# Altium schematic sheet 10-ESP32.SchDoc: KARGOBOT-TBOX-V2.0
size 513 x 386 mm; Page Create Date: March  8, 1995; Page Number: 4; Page Size: C; Page Count: 81; RevCode: A; DsnPath: C:\Users\Administrator\Desktop\123\KARGOBOT-TCU-ORIN-V1.1.DSN; SchematicName: KARGOBT-TCU-ORIN-V1.1; PageName: N100; PageSize: C; TopSchematic: True
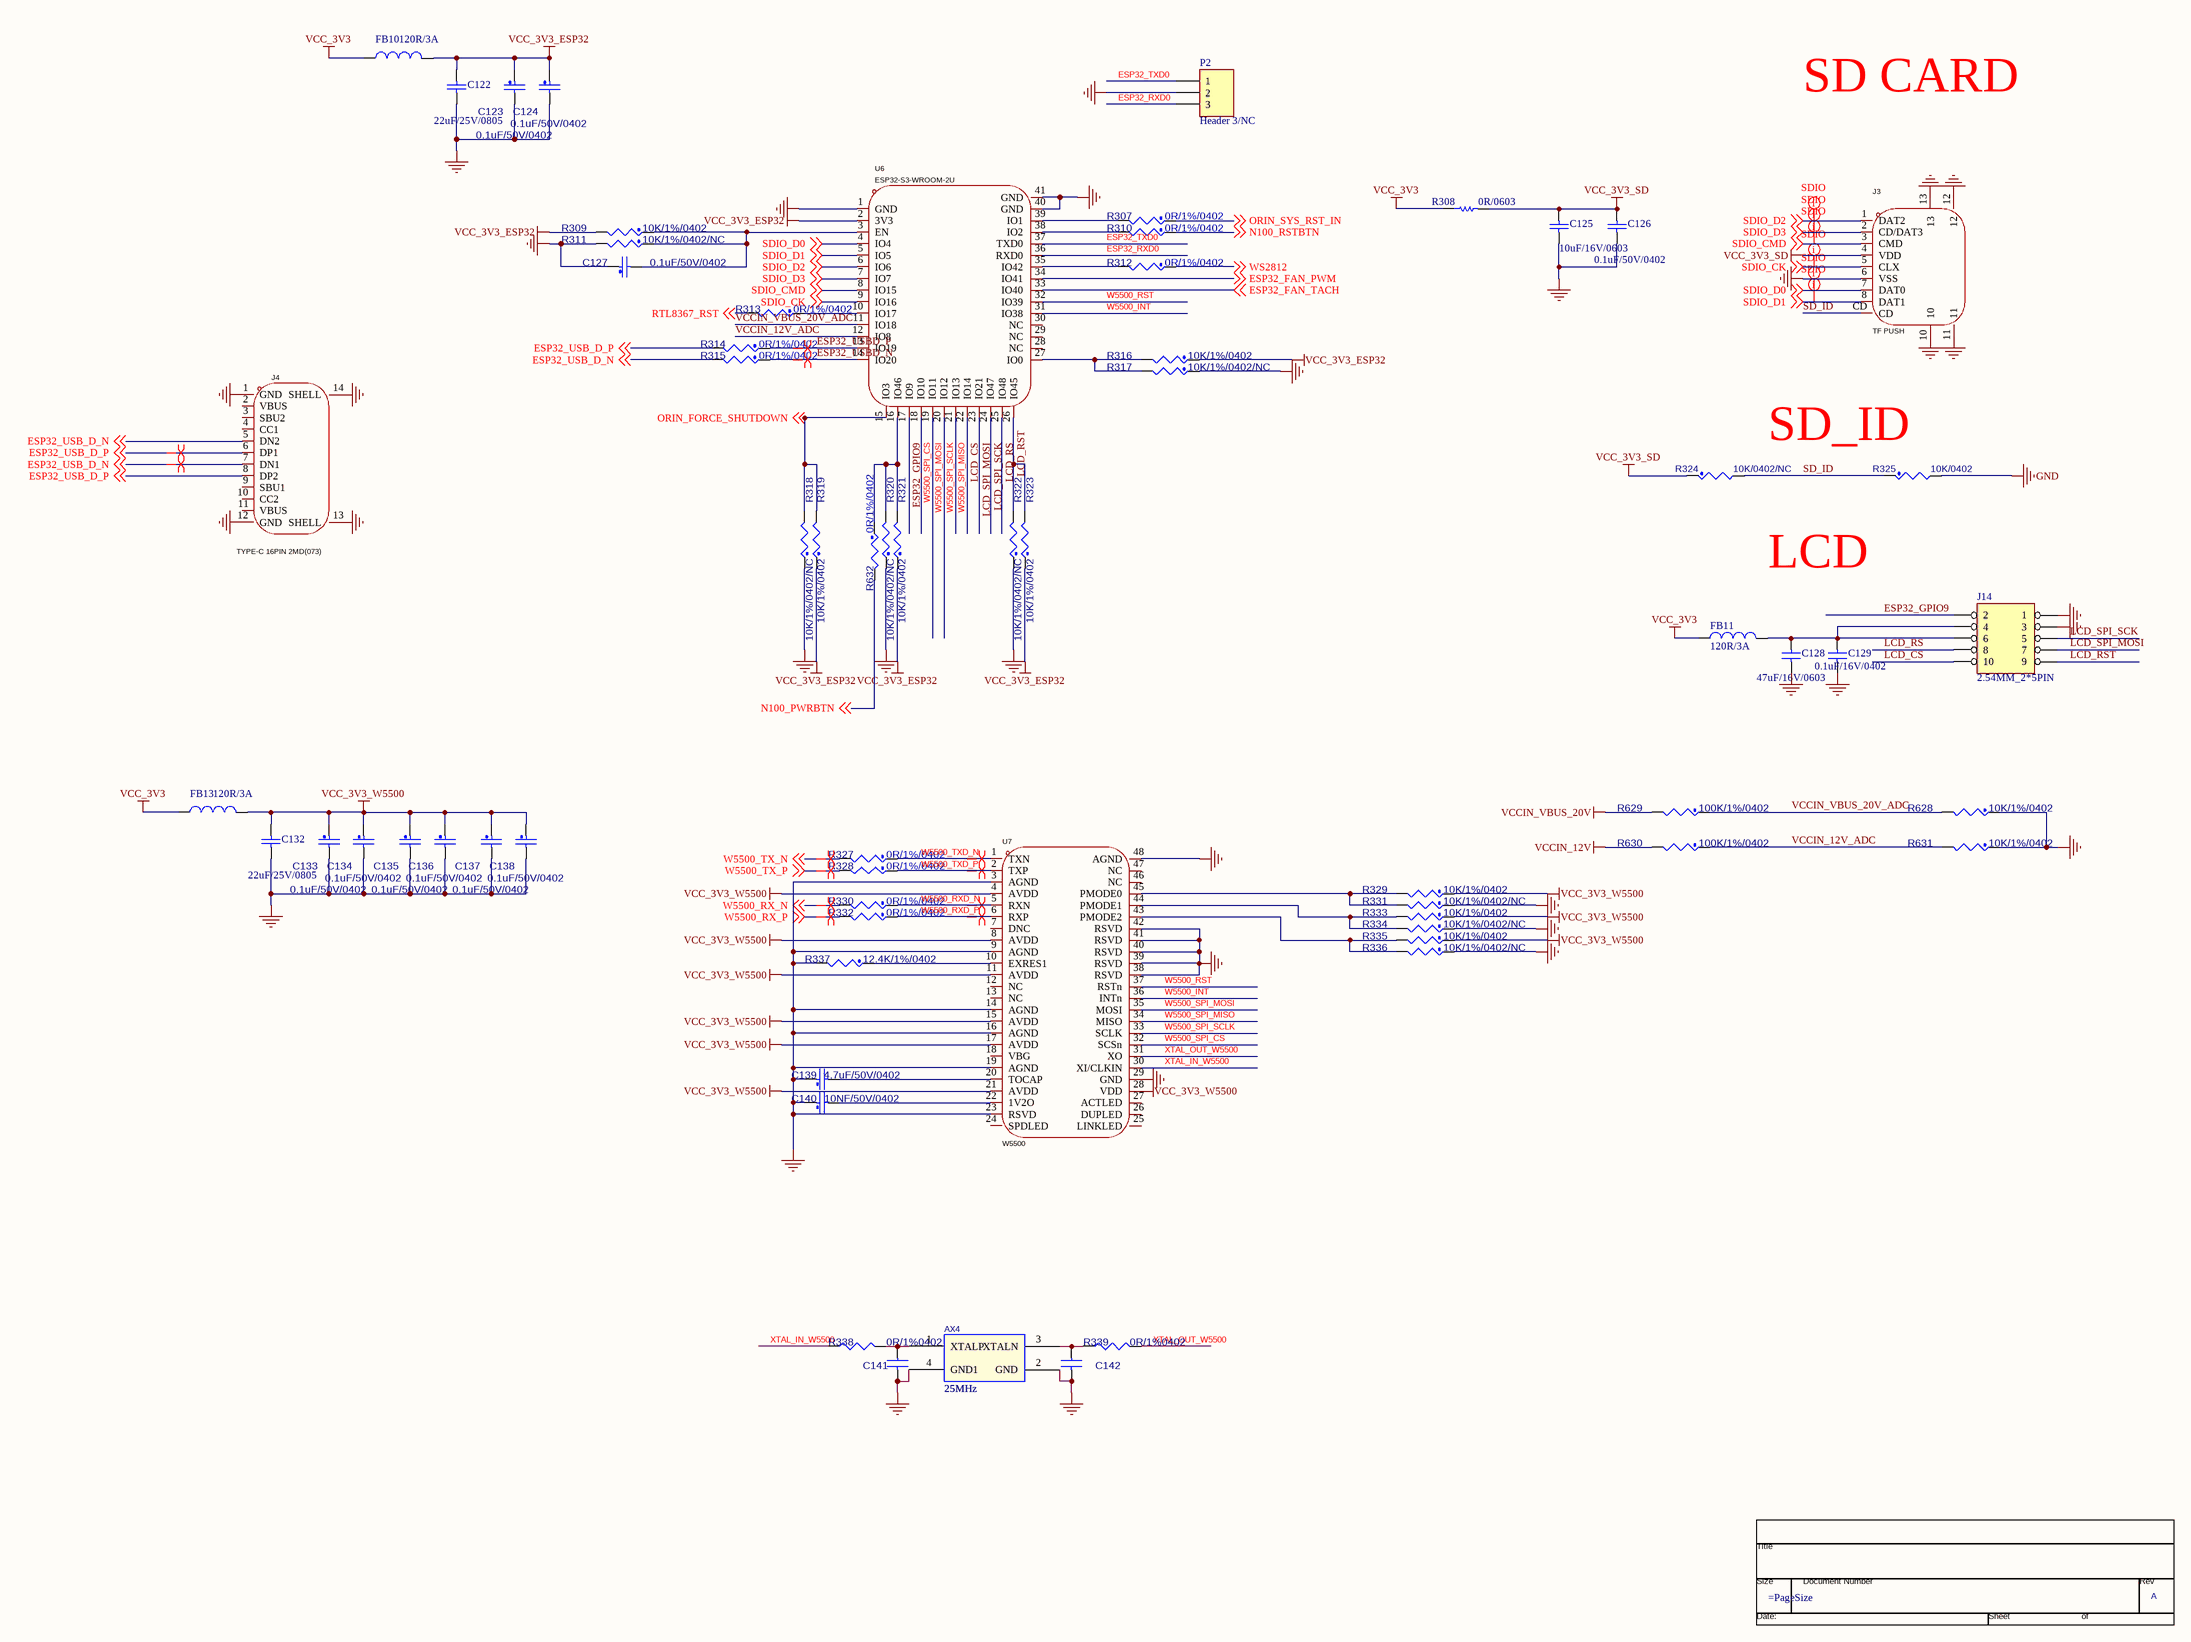
[diagram p0: 10-ESP32.SchDoc]

## Parts
*  RevCode: A  (graphical)
AX4  25MHz  [2016]
C122  22uF/25V/0805  [C0805]
C123  value 0.1uF/50V/0402  [C0402]  (hidden comment: CAP_NP)
C124  value 0.1uF/50V/0402  [C0402]  (hidden comment: CAP_NP)
C125  value 10uF/16V/0603  [C0603]  (hidden comment: HGC0603R5106M160NTHJ)
C126  0.1uF/50V/0402  [C0402]
C127  value 0.1uF/50V/0402  [C0402]  (hidden comment: CAP_NP)
C128  47uF/16V/0603  [C0603]
C129  0.1uF/16V/0402  [C0402]
C132  22uF/25V/0805  [C0805]
C133  value 0.1uF/50V/0402  [C0402]  (hidden comment: CAP_NP)
C134  value 0.1uF/50V/0402  [C0402]  (hidden comment: CAP_NP)
C135  value 0.1uF/50V/0402  [C0402]  (hidden comment: CAP_NP)
C136  value 0.1uF/50V/0402  [C0402]  (hidden comment: CAP_NP)
C137  value 0.1uF/50V/0402  [C0402]  (hidden comment: CAP_NP)
C138  value 0.1uF/50V/0402  [C0402]  (hidden comment: CAP_NP)
C139  value 4.7uF/50V/0402  [C0402]  (hidden comment: CAP_NP)
C140  value 10NF/50V/0402  [C0402]  (hidden comment: CAP_NP)
C141  CAP NP_Dup3  [C0402]  (value not drawn)
C142  CAP NP_Dup3  [C0402]  (value not drawn)
FB10  120R/3A  [L0603]
FB11  120R/3A  [L0603]
FB13  120R/3A  [L0603]
J3  TF PUSH  [TF-SMD_TF-PUSH]
J4  TYPE-C 16PIN 2MD(073)  [USB-C-SMD_TYPE-C-6PIN-2MD-073]
J14  2.54MM_2*5PIN  [IDC10]
P2  Header 3/NC  [HEADER3]
R307  value 0R/1%/0402  [R0402]  (hidden comment: RES_Dup2)
R308  0R/0603  [R0603]
R309  value 10K/1%/0402  [R0402]  (hidden comment: RES_Dup2)
R310  value 0R/1%/0402  [R0402]  (hidden comment: RES_Dup2)
R311  value 10K/1%/0402/NC  [R0402]  (hidden comment: RES_Dup2)
R312  value 0R/1%/0402  [R0402]  (hidden comment: RES_Dup2)
R313  value 0R/1%/0402  [R0402]  (hidden comment: RES_Dup2)
R314  value 0R/1%/0402  [R0402]  (hidden comment: RES_Dup2)
R315  value 0R/1%/0402  [R0402]  (hidden comment: RES_Dup2)
R316  value 10K/1%/0402  [R0402]  (hidden comment: RES_Dup2)
R317  value 10K/1%/0402/NC  [R0402]  (hidden comment: RES_Dup2)
R318  value 10K/1%/0402/NC  [R0402]  (hidden comment: RES_Dup2)
R319  value 10K/1%/0402  [R0402]  (hidden comment: RES_Dup2)
R320  value 10K/1%/0402/NC  [R0402]  (hidden comment: RES_Dup2)
R321  value 10K/1%/0402  [R0402]  (hidden comment: RES_Dup2)
R322  value 10K/1%/0402/NC  [R0402]  (hidden comment: RES_Dup2)
R323  value 10K/1%/0402  [R0402]  (hidden comment: RES_Dup2)
R324  10K/0402/NC  [R0402]
R325  10K/0402  [R0402]
R327  value 0R/1%/0402  [R0402]  (hidden comment: RES_Dup2)
R328  value 0R/1%/0402  [R0402]  (hidden comment: RES_Dup2)
R329  value 10K/1%/0402  [R0402]  (hidden comment: RES_Dup2)
R330  value 0R/1%/0402  [R0402]  (hidden comment: RES_Dup2)
R331  value 10K/1%/0402/NC  [R0402]  (hidden comment: RES_Dup2)
R332  value 0R/1%/0402  [R0402]  (hidden comment: RES_Dup2)
R333  value 10K/1%/0402  [R0402]  (hidden comment: RES_Dup2)
R334  value 10K/1%/0402/NC  [R0402]  (hidden comment: RES_Dup2)
R335  value 10K/1%/0402  [R0402]  (hidden comment: RES_Dup2)
R336  value 10K/1%/0402/NC  [R0402]  (hidden comment: RES_Dup2)
R337  value 12.4K/1%/0402  [R0402]  (hidden comment: RES_Dup2)
R338  value 0R/1%0402  [R0402]  (hidden comment: R_Dup3)
R339  value 0R/1%0402  [R0402]  (hidden comment: R_Dup3)
R628  value 10K/1%/0402  [R0402]  (hidden comment: RES_Dup2)
R629  value 100K/1%/0402  [R0402]  (hidden comment: RES_Dup2)
R630  value 100K/1%/0402  [R0402]  (hidden comment: RES_Dup2)
R631  value 10K/1%/0402  [R0402]  (hidden comment: RES_Dup2)
R632  value 0R/1%/0402  [R0402]  (hidden comment: RES_Dup2)
U6  ESP32-S3-WROOM-2U  [ESP32-S3-WROOM-2]
U7  W5500  [LQFP-48_L7.0-W7.0-P0.50-LS9.0-BL]

## Nets
GND: AX4.2(GND) AX4.4(GND1) C122.1 C123.2 C124.2 C125.1 C126.1 C127.1 C128.1 C129.1 C132.1 C133.2 C134.2 C135.2 C136.2 C137.2 C138.2 C139.1 C140.1 C141.2 C142.2 J3.6(VSS) J3.10 J3.11 J3.12 J3.13 J4.1(GND) J4.12(GND) J4.13(SHELL) J4.14(SHELL) J14.1 J14.3 P2.2 R311.2 R317.1 R318.1 R320.1 R322.1 R325.2 R331.1 R334.1 R336.1 R337.2 R628.1 R631.1 U6.1(GND) U6.40(GND) U6.41(GND) U7.3(AGND) U7.9(AGND) U7.14(AGND) U7.16(AGND) U7.19(AGND) U7.23(RSVD) U7.29(GND) U7.38(RSVD) U7.39(RSVD) U7.40(RSVD) U7.41(RSVD) U7.42(RSVD) U7.48(AGND)
VCC_3V3: FB10.1 FB11.2 FB13.1 R308.1
VCC_3V3_ESP32: C122.2 C123.1 C124.1 FB10.2 R309.2 R316.1 R319.1 R321.1 R323.1 U6.2(3V3)
VCC_3V3_SD: C125.2 C126.2 J3.4(VDD) R308.2 R324.1
VCC_3V3_W5500: C132.2 C133.1 C134.1 C135.1 C136.1 C137.1 C138.1 FB13.2 R329.1 R333.1 R335.1 U7.4(AVDD) U7.8(AVDD) U7.11(AVDD) U7.15(AVDD) U7.17(AVDD) U7.21(AVDD) U7.28(VDD)
VCCIN_12V: R630.2
VCCIN_VBUS_20V: R629.2
ESP32_FAN_PWM: U6.34(IO41) ; off-sheet ESP32_FAN_PWM
ESP32_FAN_TACH: U6.33(IO40) ; off-sheet ESP32_FAN_TACH
ESP32_GPIO9: J14.2 U6.17(IO9)
ESP32_RXD0: P2.3 U6.36(RXD0)
ESP32_TXD0: P2.1 U6.37(TXD0)
ESP32_USB_D_N: J4.5(DN2) J4.7(DN1) R315.2 ; off-sheet ESP32_USB_D_N
ESP32_USB_D_P: J4.6(DP1) J4.8(DP2) R314.2 ; off-sheet ESP32_USB_D_P
ESP32_USBD_N: R315.1 U6.14(IO20)
ESP32_USBD_P: R314.1 U6.13(IO19)
LCD_CS: J14.10 U6.22(IO14)
LCD_RS: J14.8 U6.25(IO48)
LCD_RST: J14.9 R322.2 R323.2 U6.26(IO45)
LCD_SPI_MOSI: J14.7 U6.23(IO21)
LCD_SPI_SCK: J14.5 U6.24(IO47)
N100_PWRBTN: R632.2 ; off-sheet N100_PWRBTN
N100_RSTBTN: R310.1 ; off-sheet N100_RSTBTN
ORIN_FORCE_SHUTDOWN: R318.2 R319.2 U6.15(IO3) ; off-sheet ORIN_FORCE_SHUTDOWN
ORIN_SYS_RST_IN: R307.1 ; off-sheet ORIN_SYS_RST_IN
RTL8367_RST: R313.2 ; off-sheet RTL8367_RST
SD_ID: J3.CD R324.2 R325.1
SDIO_CK: J3.5(CLX) U6.9(IO16) ; off-sheet SDIO_CK
SDIO_CMD: J3.3(CMD) U6.8(IO15) ; off-sheet SDIO_CMD
SDIO_D0: J3.7(DAT0) U6.4(IO4) ; off-sheet SDIO_D0
SDIO_D1: J3.8(DAT1) U6.5(IO5) ; off-sheet SDIO_D1
SDIO_D2: J3.1(DAT2) U6.6(IO6) ; off-sheet SDIO_D2
SDIO_D3: J3.2(CD/DAT3) U6.7(IO7) ; off-sheet SDIO_D3
VCCIN_12V_ADC: R630.1 R631.2 U6.12(IO8)
VCCIN_VBUS_20V_ADC: R628.2 R629.1 U6.11(IO18)
W5500_INT: U6.31(IO38) U7.36(INTn)
W5500_RST: U6.32(IO39) U7.37(RSTn)
W5500_RX_N: R330.2 ; off-sheet W5500_RX_N
W5500_RX_P: R332.2 ; off-sheet W5500_RX_P
W5500_RXD_N: R330.1 U7.5(RXN)
W5500_RXD_P: R332.1 U7.6(RXP)
W5500_SPI_CS: U6.18(IO10) U7.32(SCSn)
W5500_SPI_MISO: U6.21(IO13) U7.34(MISO)
W5500_SPI_MOSI: U6.19(IO11) U7.35(MOSI)
W5500_SPI_SCLK: U6.20(IO12) U7.33(SCLK)
W5500_TX_N: R327.2 ; off-sheet W5500_TX_N
W5500_TX_P: R328.2 ; off-sheet W5500_TX_P
W5500_TXD_N: R327.1 U7.1(TXN)
W5500_TXD_P: R328.1 U7.2(TXP)
WS2812: R312.1 ; off-sheet WS2812
XTAL_IN_W5500: R338.1 U7.30(XI/CLKIN)
XTAL_OUT_W5500: R339.2 U7.31(XO)
NetAX4_1: AX4.1(XTALP) C141.1 R338.2
NetAX4_3: AX4.3(XTALN) C142.1 R339.1
NetC127_2: C127.2 R309.1 R311.1 U6.3(EN)
NetC128_2: C128.2 C129.2 FB11.1 J14.4 J14.6
NetC139_2: C139.2 U7.20(TOCAP)
NetC140_2: C140.2 U7.22(1V2O)
NetR307_2: R307.2 U6.39(IO1)
NetR310_2: R310.2 U6.38(IO2)
NetR312_2: R312.2 U6.35(IO42)
NetR313_1: R313.1 U6.10(IO17)
NetR316_2: R316.2 R317.2 U6.27(IO0)
NetR320_2: R320.2 R321.2 R632.1 U6.16(IO46)
NetR329_2: R329.2 R331.2 U7.45(PMODE0)
NetR333_2: R333.2 R334.2 U7.44(PMODE1)
NetR335_2: R335.2 R336.2 U7.43(PMODE2)
NetR337_1: R337.1 U7.10(EXRES1)

Not connected (* = marked no-connect by the designer): J4 2(VBUS) 3(SBU2) 4(CC1) 9(SBU1) 10(CC2) 11(VBUS); U6 28(NC) 29(NC) 30(NC); U7 7(DNC) 12(NC) 13(NC) 18(VBG) 24(SPDLED) 25(LINKLED) 26(DUPLED) 27(ACTLED) 46(NC) 47(NC)

## Layout directives
net class SDIO: SDIO_CK, SDIO_CMD, SDIO_D0, SDIO_D1, SDIO_D2, SDIO_D3
differential pair: ESP32_USB_D_N, ESP32_USB_D_P, ESP32_USBD_N, ESP32_USBD_P, W5500_RX_N, W5500_RX_P, W5500_RXD_N, W5500_RXD_P, W5500_TX_N, W5500_TX_P, W5500_TXD_N, W5500_TXD_P

## Notes on the sheet
- SD CARD
- (near R325) SD_ID
- LCD
- (in symbol TitleBlock0) Title; Size; Document Number; Rev; Date:; Sheet; of

## Library data of the parts
* = TitleBlock0: Page Count: 81; Page Number: 4; Title: KARGOBOT-TBOX-V2.0; Page Size: =PageSize; Page Create Date: March  8, 1995; Page Modify Date: =ModifiedDate
AX4 = XTAL_0: Part Reference: AX3; PCB Footprint: CRY5032; Value: 25MHz
C122 C126 C128 C129 C132 = CAP: Capacitor; Value: 100pF; Published: 8-Jun-2000; Revision: July-2002: Re-released for DXP Platform.; Publisher: Altium Limited
C123 C124 C127 C133-C140 = CAP_NP: GCM155R71H104KE02/MURATA; Part Reference: C15; CLASS: DISCRETE; FPLIST: CC0402_25,CC0402_HD,CC0402_CC; CAD_APPROVED: Yes; MFG_PN01: 0402YC104KAT2A; MFG_NAME01: AVX; Tolerance: 10%; AGILE_PN: 150-75182; VOLTAGE: 16V; HEIGHT: 0.635MM; ROHS: Yes; TOL: 10%; PCB Footprint: C0402
C125 = CAP: Capacitor; Published: 8-Jun-2000; Revision: July-2002: Re-released for DXP Platform.; Publisher: Altium Limited
C141 = CAP NP_Dup3: Part Reference: C71; Value: 20pF/50V X7R; PCB Footprint: C0402
C142 = CAP NP_Dup3: Part Reference: C72; Value: 20pF/50V X7R; PCB Footprint: C0402
FB10 FB11 FB13 = Inductor: BLM18KG121TN1D; Code_IEC: 1005; Value: 10mH; Published: 8-Jun-2000; LatestRevisionDate: 29-May-2009; LatestRevisionNote: IPC-7351 Footprint Added.; PackageReference: 0402-A; Publisher: Altium Limited; PackageDescription: Chip Inductor; Code_JEITA: 0402
J3 = TF PUSH: Manufacturer: SHOU HAN(首韩); Add into BOM: yes; Card Connection Mode: 自弹式; Card Type: MicroSD卡(TF卡); Connector Type: 卡座; Maximum Body Height: 2mm; Additional Card Detection Pins: 无; Symbol: TF PUSH; Device: TF PUSH; LCSC Part Name: 自弹式 MicroSD卡(TF卡) 卡座; Supplier Part: C393941; Manufacturer Part: TF PUSH; Supplier Footprint: SMD; JLCPCB Part Class: Extended Part; Datasheet: https://atta.szlcsc.com/upload/public/pdf/source/20191011/C393941_0DDD896EE907FEB750D8B7B8982E2A67.pdf; Supplier: LCSC; Convert to PCB: yes; Contact Material: -; Contact Plating: -; Operating Temperature Range: -20℃~+90℃; Soldering Temperature(Max): -; Supplementary Features: -; Comment_1: TF PUSH
J4 = TYPE-C 16PIN 2MD(073): Manufacturer: SHOU HAN(首韩); Add into BOM: yes; Gender: 母; Number of Contacts: 16P; Number of Ports: 1; Current Rating - Power (Max): 5A; Rated Voltage (Max): 5V; Connect-Disconnect Life: 5千次; Core Colour: 黑色; Symbol: TYPE-C 16PIN 2MD(073); Device: TYPE-C 16PIN 2MD(073); LCSC Part Name: Type-C 母 卧贴; Supplier Part: C2765186; Manufacturer Part: TYPE-C 16PIN 2MD(073); Supplier Footprint: SMD; JLCPCB Part Class: Extended Part; Datasheet: https://atta.szlcsc.com/upload/public/pdf/source/20211123/39B17C16241EAC15C5E277BDA434118E.pdf; Supplier: LCSC; Convert to PCB: yes; Connector Type: Type-C; Standard: USB 3.1; Mounting Style: 卧贴; Operating Temperature Range: -25℃~+85℃; Comment_1: TYPE-C 16PIN 2MD(073)
J14 = HEADER 5X2
P2 = Header 3: Header, 3-Pin; LatestRevisionDate: 17-Jul-2002; LatestRevisionNote: Re-released for DXP Platform.; Publisher: Altium Limited
R307 R310 R312 R314 R327 R328 R330 R332 R632 = RES_Dup2: AC0402FR-070RL/YAGEO; Part Reference: R97; CLASS: DISCRETE; SIGNAL_MODEL: DEFAULT_RESISTOR_33.000000OHM_2_1; FPLIST: RC0603_OV; CAD_APPROVED: Yes; MFG_PN01: CR-02FL6---33R; MFG_NAME01: YAGEO; Tolerance: 1%; AGILE_PN: 470-75790; TOL: 5%; ROHS: Yes; HEIGHT: 0.4MM; PCB Footprint: R0402
R308 = Res Semi: Semiconductor Resistor; Value: 1K; Published: 8-Jun-2000; LatestRevisionDate: 17-Jul-2002; LatestRevisionNote: Re-released for DXP Platform.; PackageReference: AXIAL-0.5; Publisher: Altium Limited; PackageDescription: Axial Device, Thru-Hole; 2 Leads; 0.5 in Pin Spacing
R309 R311 R316-R323 R329 R331 R333-R337 R628-R631 = RES_Dup2: AC0402FR-0710KL/YAGEO; Part Reference: R94; CLASS: DISCRETE; PCB Footprint: R0402
R313 R315 = RES_Dup2: AC0402FR-070RL/YAGEO; Part Reference: R98; CLASS: DISCRETE; TOL: 5%; AGILE_PN: 470-75790; Tolerance: 1%; MFG_NAME01: YAGEO; MFG_PN01: CR-02FL6---33R; CAD_APPROVED: Yes; FPLIST: RC0603_OV; SIGNAL_MODEL: DEFAULT_RESISTOR_33.000000OHM_2_1; HEIGHT: 0.4MM; ROHS: Yes; PCB Footprint: R0402
R324 R325 = RES_Dup1: RES MF 1.0K 1/16W 5% 0402; CLASS: DISCRETE; AGILE_PN: 470-75555; MFG_NAME01: VISHAY INTERTECHNOLOGY; MFG_PN01: CRCW04021K00JNED; CAD_APPROVED: Yes; FPLIST: RC0402_25,RC0402_HD,RC0402_CC; HEIGHT: 0.41mm; TOL: 5%; Tolerance: 5%; ROHS: Yes
R338 = R_Dup3: Part Reference: R130; PCB Footprint: R0402
R339 = R_Dup3: Part Reference: R131; PCB Footprint: R0402
U6 = ESP32-S3-WROOM-2-N32R8V: Manufacturer: ESPRESSIF(乐鑫); Add into BOM: yes; Core Processor: ESP32-S3R8V芯片; Support Interface: I2C；GPIO；SPI；PWM；ADC；UART；USB；I2S; Value: 2.4GHz; Output Power: 20.5dBm; Symbol: ESP32-S3-WROOM-2-N32R8V; Device: ESP32-S3-WROOM-2-N32R8V; LCSC Part Name: ESP32-S3-WROOM-2-N32R8V; Supplier Part: C3021270; Manufacturer Part: ESP32-S3-WROOM-2-N32R8V; Supplier Footprint: SMD-41P; JLCPCB Part Class: Extended Part; Datasheet: https://atta.szlcsc.com/upload/public/pdf/source/20240130/C1D348304CAAF72A05B43D2BF874139A.pdf; Supplier: LCSC; Convert to PCB: yes; Comment_1: 2.4GHz
U7 = W5500: Manufacturer: WIZNET; Add into BOM: yes; channel: 8; IO Type: SPI; Supply Voltage: 3.3V; Supply Current: 132mA; Symbol: W5500; Device: W5500; LCSC Part Name: 硬连线TCP/IP嵌入式以太网控制器; Supplier Part: C32843; Manufacturer Part: W5500; Supplier Footprint: LQFP-48(7x7); JLCPCB Part Class: Extended Part; Datasheet: https://atta.szlcsc.com/upload/public/pdf/source/20230714/E10C32B058E0BA54FCE1C1556BE10C07.pdf; Supplier: LCSC; Convert to PCB: yes; Operating Temperature  range: -40℃~+85℃; Comment_1: W5500